# EAGLE design tick-mk-4.4 (EAGLE 6.5.0)
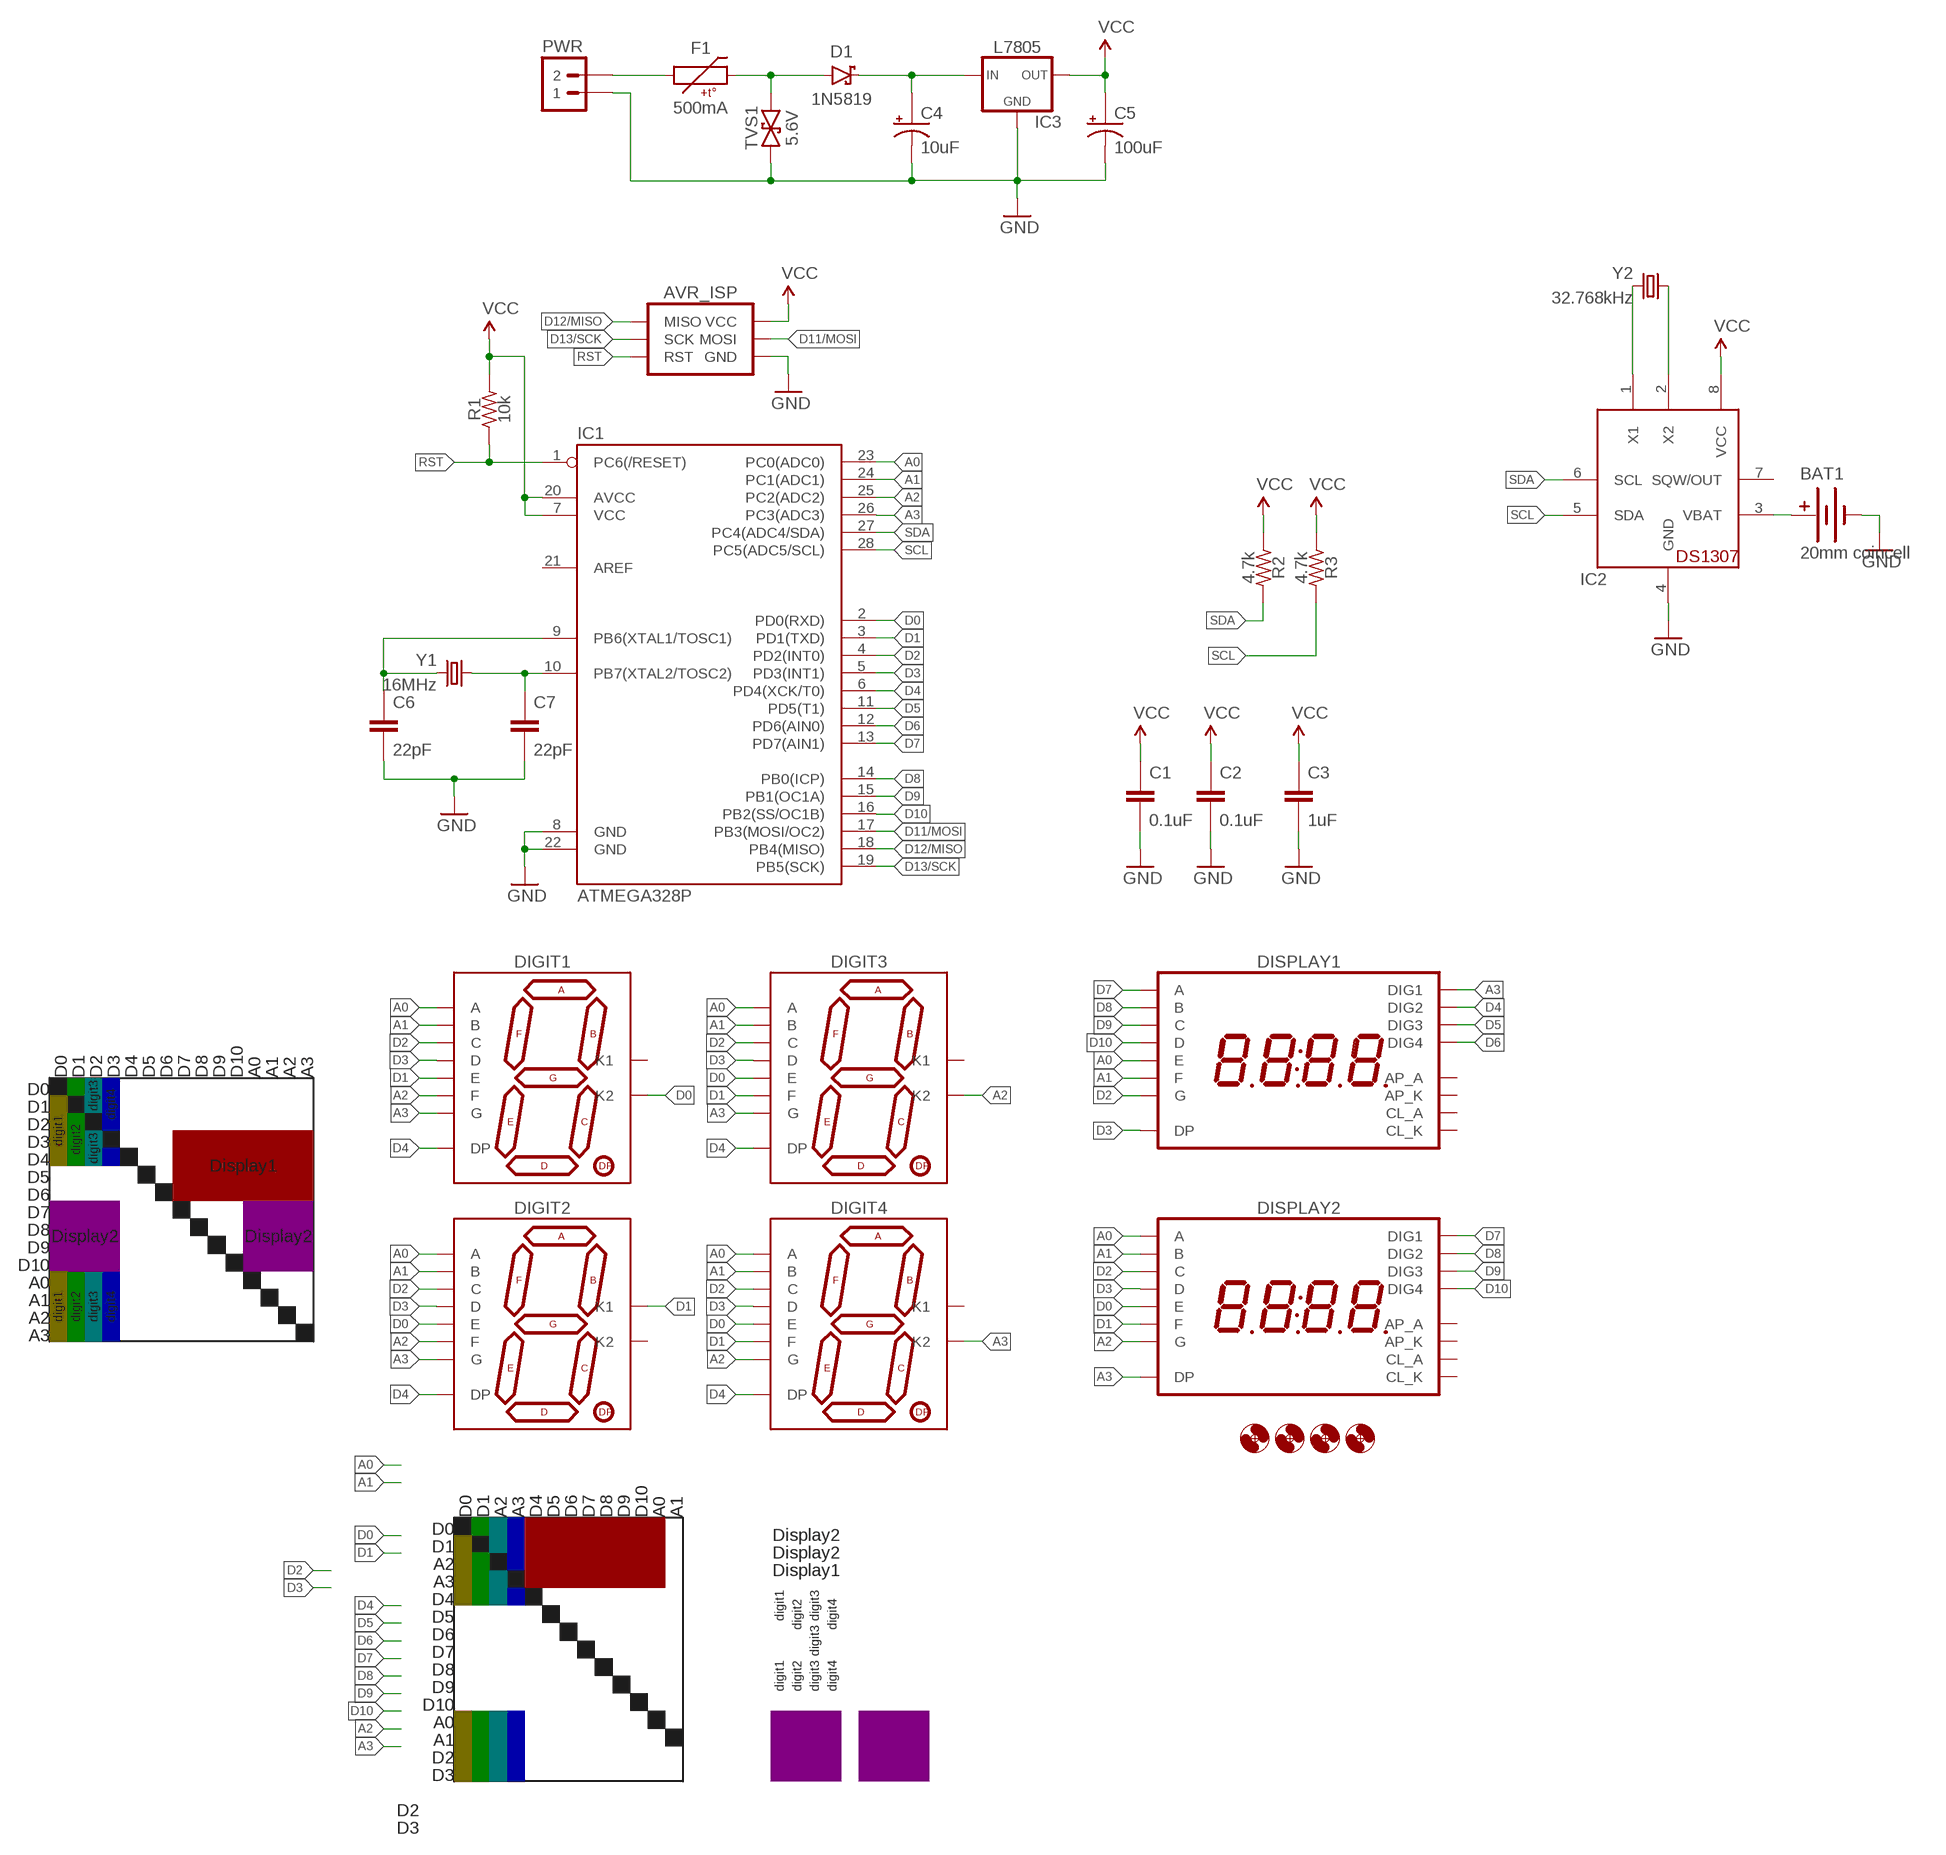
[diagram p0: schematic, sheet 1]

## Parts
AVR_ISP  AVR_SPI_PRG_6PTH  [2X3]
BAT1  20mm coincell  BATTERY20MMSMD-MINE  [BATTCON_20MM_MINE]
C1  0.1uF  CAPACITOR-CERAMIC025-024X044  [C025-024X044]
C2  0.1uF  CAPACITOR-CERAMIC025-024X044  [C025-024X044]
C3  1uF  CAPACITOR-CERAMIC025-024X044  [C025-024X044]
C4  10uF  CAPACITOR-POLARIZEDE2-5  [E2-5]
C5  100uF  CAPACITOR-POLARIZEDE2.5-6  [E2,5-6]
C6  22pF  CAPACITOR-CERAMIC025-024X044  [C025-024X044]
C7  22pF  CAPACITOR-CERAMIC025-024X044  [C025-024X044]
D1  1N5819  DIODE-SCHOTTKYPTH-10.16MM  [DIODE-10.16MM]
DIGIT1  7SEG_1DIGPTH-25.4MM-BARE  [7SEG_1DIG_25.4MM_NOSILK]
DIGIT2  7SEG_1DIGPTH-25.4MM-BARE  [7SEG_1DIG_25.4MM_NOSILK]
DIGIT3  7SEG_1DIGPTH-25.4MM-BARE  [7SEG_1DIG_25.4MM_NOSILK]
DIGIT4  7SEG_1DIGPTH-25.4MM-BARE  [7SEG_1DIG_25.4MM_NOSILK]
DISPLAY1  7SEG_4DIGIT_COLON_APOS  [7SEG_4DIG_10MM]
DISPLAY2  7SEG_4DIGIT_COLON_APOS  [7SEG_4DIG_10MM]
F1  500mA  PTCPTH-5.08MM  [PTC-PTH-5.08MM]
H1  HOLE#2  [HOLE-#2]
H2  HOLE#2  [HOLE-#2]
H3  HOLE#2  [HOLE-#2]
H4  HOLE#2  [HOLE-#2]
IC1  ATMEGA328P  ATMEGA328P_PDIP  [DIL28-3]
IC2  DS1307  [DIL08]
IC3  L7805  V_REG_78XXTO-220-THERMPAD  [TO220-IGO-THERMPAD]
PWR  M02JST-PTH-VERT  [JST-2-PH-VERT-PTH]
R1  10k  RESISTORPTH-AXIAL-7.62MM  [RESISTOR-AXIAL-PTH-7.62MM]
R2  4.7k  RESISTORPTH-AXIAL-7.62MM  [RESISTOR-AXIAL-PTH-7.62MM]
R3  4.7k  RESISTORPTH-AXIAL-7.62MM  [RESISTOR-AXIAL-PTH-7.62MM]
TVS1  5.6V  TVSDO-41-10.16MM  [DO-41-TVS-BI-10.16MM]
Y1  16MHz  CRYSTALHC49UV  [HC49U-V]
Y2  32.768kHz  CRYSTALTC26H  [TC26H]

## Nets
A0: DIGIT1.7(A) DIGIT2.7(A) DIGIT3.7(A) DIGIT4.7(A) DISPLAY1.5(E) DISPLAY2.14(A) IC1.23(PC0(ADC0))
A1: DIGIT1.6(B) DIGIT2.6(B) DIGIT3.6(B) DIGIT4.6(B) DISPLAY1.11(F) DISPLAY2.16(B) IC1.24(PC1(ADC1))
A2: DIGIT1.9(F) DIGIT2.9(F) DIGIT3.8(K2) DIGIT4.10(G) DISPLAY2.15(G) IC1.25(PC2(ADC2))
A3: DIGIT1.10(G) DIGIT2.10(G) DIGIT3.10(G) DIGIT4.8(K2) DISPLAY1.1(DIG1) DISPLAY2.7(DP) IC1.26(PC3(ADC3))
D0: DIGIT1.8(K2) DIGIT2.1(E) DIGIT3.1(E) DIGIT4.1(E) DISPLAY2.5(E) IC1.2(PD0(RXD))
D1: DIGIT1.1(E) DIGIT2.3(K1) DIGIT3.9(F) DIGIT4.9(F) DISPLAY2.11(F) IC1.3(PD1(TXD))
D2: DIGIT1.4(C) DIGIT2.4(C) DIGIT3.4(C) DIGIT4.4(C) DISPLAY1.15(G) DISPLAY2.13(C) IC1.4(PD2(INT0))
D3: DIGIT1.2(D) DIGIT2.2(D) DIGIT3.2(D) DIGIT4.2(D) DISPLAY1.7(DP) DISPLAY2.3(D) IC1.5(PD3(INT1))
D4: DIGIT1.5(DP) DIGIT2.5(DP) DIGIT3.5(DP) DIGIT4.5(DP) DISPLAY1.2(DIG2) IC1.6(PD4(XCK/T0))
D5: DISPLAY1.6(DIG3) IC1.11(PD5(T1))
D6: DISPLAY1.8(DIG4) IC1.12(PD6(AIN0))
D7: DISPLAY1.14(A) DISPLAY2.1(DIG1) IC1.13(PD7(AIN1))
D8: DISPLAY1.16(B) DISPLAY2.2(DIG2) IC1.14(PB0(ICP))
D9: DISPLAY1.13(C) DISPLAY2.6(DIG3) IC1.15(PB1(OC1A))
D10: DISPLAY1.3(D) DISPLAY2.8(DIG4) IC1.16(PB2(SS/OC1B))
D11/MOSI: AVR_ISP.4(MOSI) IC1.17(PB3(MOSI/OC2))
D12/MISO: AVR_ISP.1(MISO) IC1.18(PB4(MISO))
D13/SCK: AVR_ISP.3(SCK) IC1.19(PB5(SCK))
GND: AVR_ISP.6(GND) BAT1.BOTTOM(-) C1.2 C2.2 C3.2 C4.- C5.- C6.2 C7.2 IC1.8(GND) IC1.22(GND) IC2.4(GND) IC3.4(GND) IC3.GND PWR.1 TVS1.P$1
N$1: BAT1.TOP@1(+) BAT1.TOP@2(+) IC2.3(VBAT)
N$2: IC2.1(X1) Y2.2
N$3: IC2.2(X2) Y2.1
N$4: D1.A F1.P$2 TVS1.P$2
N$6: C6.1 IC1.9(PB6(XTAL1/TOSC1)) Y1.2
N$7: F1.P$1 PWR.2
N$8: C4.+ D1.C IC3.IN
N$9: C7.1 IC1.10(PB7(XTAL2/TOSC2)) Y1.1
RST: AVR_ISP.5(RST) IC1.1(PC6(/RESET)) R1.P$1
SCL: IC1.28(PC5(ADC5/SCL)) IC2.5(SDA) R3.P$2
SDA: IC1.27(PC4(ADC4/SDA)) IC2.6(SCL) R2.P$2
VCC: AVR_ISP.2(VCC) C1.1 C2.1 C3.1 C5.+ IC1.7(VCC) IC1.20(AVCC) IC2.8(VCC) IC3.OUT R1.P$2 R2.P$1 R3.P$1
Unconnected: DIGIT1.3(K1) DIGIT2.8(K2) DIGIT3.3(K1) DIGIT4.3(K1) DISPLAY1.4(CL_A) DISPLAY1.9(AP_K) DISPLAY1.10(AP_A) DISPLAY1.12(CL_K) DISPLAY2.4(CL_A) DISPLAY2.9(AP_K) DISPLAY2.10(AP_A) DISPLAY2.12(CL_K) IC1.21(AREF) IC2.7(SQW/OUT)

## Notes on the sheet
- D0 | D1 | D2 | D3 | D4 | D5 | D6 | D7 | D8 | D9 | D10 | A0 | A1 | A2 | A3
- D0 | digit3
- digit4
- D1
- D2 | digit1
- digit2
- D3 | digit3
- D4 | Display1
- D5
- D6
- D7
- D8 | Display2 | Display2
- D9
- D10
- A0
- A1 | digit1 | digit2 | digit3 | digit4
- A2
- A3
- D0 | D1 | A2 | A3 | D4 | D5 | D6 | D7 | D8 | D9 | D10 | A0 | A1
- D0 | Display2
- D1 | Display2
- A2 | Display1
- A3
- D4 | digit1 | digit3
- digit2 | digit4
- D5
- D6 | digit3
- D7
- D8 | digit1 | digit2 | digit3 | digit4
- D9
- D10
- A0
- A1
- D2
- D3
- D2
- D3

## Library data of the parts
AVR_ISP = A_butts:AVR_SPI_PRG_6: AVR ISP 6 Pin This is the reduced ISP connector for AVR programming. Common on Arduino. This footprint will take up less PCB space and can be used with a 10-pin to 6-pin adapter such as SKU: BOB-08508 **Special note about "TEST_POINT" package. The stop mask is on the top side, so if you want your programming test points to be on the bottom of your board, make sure to place this package on the bottom side of the board. This also ensure that the orientation to program from the bottom side will be correct.
BAT1 = A_butts:BATTERY: Battery Holders Various common sizes : AA, AAA, 20mm coin cell and 12mm coin cell. 20MM_4LEGS, BATT-10373
C1-C3 C6 C7 = A_butts:CAPACITOR-CERAMIC: CAPACITOR, European symbol
C4 C5 = A_butts:CAPACITOR-POLARIZED: POLARIZED CAPACITOR, American symbol
D1 = A_butts:DIODE-SCHOTTKY: Schottky diodes in SFE's production catalog BAT20J 1A 23V 0.62Vf RB751 120mA 40V 0.37Vf PMEG4005EJ 0.5A 40V 0.42Vf MBRA140 1A 40V 0.5Vf B340A 3A 40V SMA
DIGIT1-DIGIT4 = A_butts:7SEG_1DIG
DISPLAY1 DISPLAY2 = A_butts:7SEG_4DIGIT_COLON_APOS
F1 = A_butts:PTC: Resettable Fuse PTC Resettable Fuse. Spark Fun Electronics SKU : COM-08357
H1-H4 = A_butts:HOLE: MOUNTING HOLE with drill center marker
IC1 = A_butts:ATMEGA328P_PDIP: uC used in the Arduino 32kb flash, 1k EEPROM, 2k SRAM This is the through-hole version of this chip.
IC2 = A_butts:DS1307: DS1307 Real time clock (RTC) with battery backup ability. Talk to it via i2c
IC3 = A_butts:V_REG_78XX: Voltage Regulator Standard 7805 5V regulator. IGO (Input Ground Output). Spark Fun Electronics SKU : COM-00107
PWR = A_butts:M02: Standard 2-pin 0.1" header. Use with - straight break away headers ( PRT-00116) - right angle break away headers (PRT-00553) - swiss pins (PRT-00743) - machine pins (PRT-00117) - female headers (PRT-00115) Molex polarized connector foot print use with: PRT-08233 with associated crimp pins and housings. 2.54_SCREWTERM for use with PRT-10571. 3.5mm Screw Terminal footprints for PRT-08084 5mm Screw Terminal footprints for use with PRT-08433
R1-R3 = A_butts:RESISTOR: RESISTOR, American symbol
TVS1 = A_butts:TVS: Transient voltage suppressor- prevents ESD on inputs. Ignore package description- MBRA140 is NOT this type of part!!!
Y1 Y2 = A_butts:CRYSTAL: Various standard crystals. Proven footprints. Spark Fun Electronics SKU : COM-00534

## Board
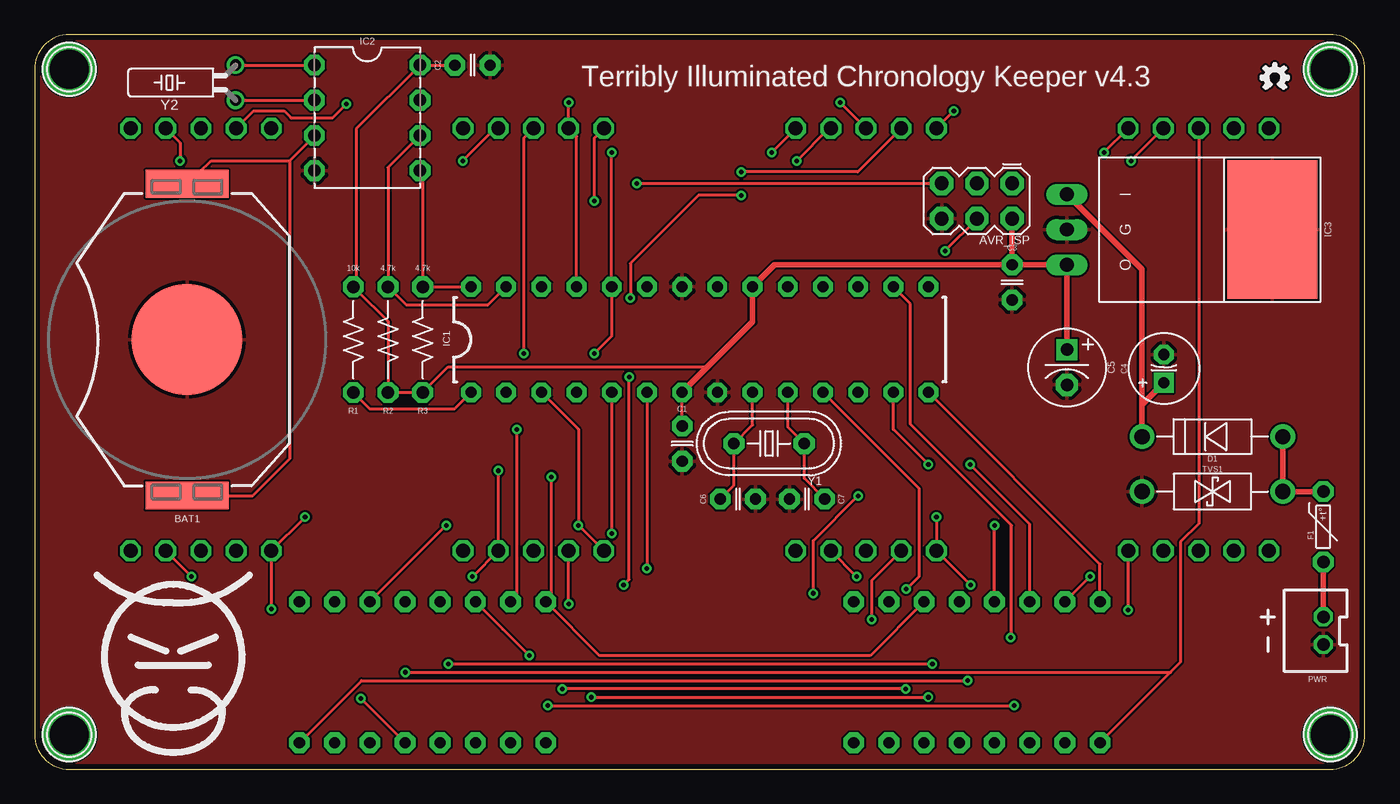
[diagram p1: board, top side]
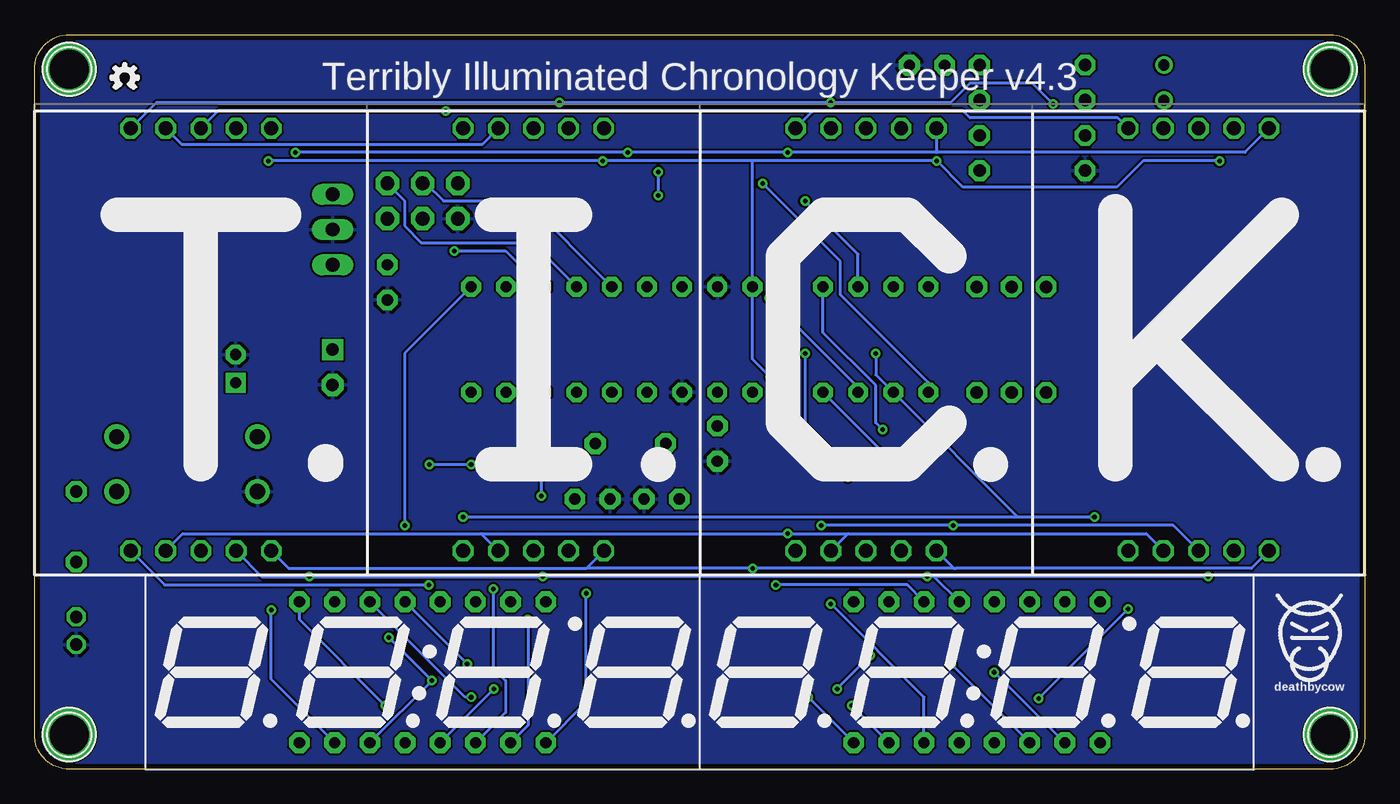
[diagram p2: board, bottom side, seen from below]

Size 96 x 53 mm. Coordinates in mm from the lower left corner, seen from the top.
Outline: 96,2.5 96,50.5 arc90 93.5,53 2.5,53 arc90 0,50.5 0,2.5 arc90 2.5,0 93.5,0 arc90 96,2.5
Copper layers (1*16): Top 0.0356mm / dielectric 1.5011mm / Bottom 0.0356mm
Design rules "LaenPCBOrder2": minimum track width 6mil, minimum drill 13mil, track to track 6mil, track to pad 6mil, pad to pad 6mil, via to via 6mil, smd to smd 6mil, copper to edge 15mil, drill to drill 6mil, minimum pad ring 7mil, minimum via ring 7mil, stop-mask expansion 3mil, vias tented up to drill 20mil, thermal gap 10mil

### Footprints (pad centres in the part's own frame; a part is rotated, then mirrored left to right if it is on the bottom)
2X3 = drill 1 pad 1.676 octagon: 1 -2.54,-1.27; 2 -2.54,1.27; 3 0,-1.27; 4 0,1.27; 5 2.54,-1.27; 6 2.54,1.27
BATTCON_20MM_MINE = smd 8 x 8: BOTTOM 0,0 | smd 6 x 2: TOP@1 0,11.25; TOP@2 0,-11.25
C025-024X044 = drill 0.813 pad 1.5 octagon: 1 -1.27,0; 2 1.27,0
E2-5 = drill 0.813 pad 1.422 square: + -1.016,0 | drill 0.813 pad 1.422 octagon: - 1.016,0
E2,5-6 = drill 0.9 pad 1.524 square: + -1.27,0 | drill 0.9 pad 1.6 octagon: - 1.27,0
DIODE-10.16MM = drill 1.1 pad 1.778: A -5.08,0; C 5.08,0
7SEG_1DIG_25.4MM_NOSILK = drill 1 pad 1.5 octagon: 1 -5.08,-15.24; 2 -2.54,-15.24; 3 0,-15.24; 4 2.54,-15.24; 5 5.08,-15.24; 6 5.08,15.24; 7 2.54,15.24; 8 0,15.24; 9 -2.54,15.24; 10 -5.08,15.24
7SEG_4DIG_10MM = drill 0.8 pad 1.5 octagon: 1 -8.89,-5.08; 2 -6.35,-5.08; 3 -3.81,-5.08; 4 -1.27,-5.08; 5 1.27,-5.08; 6 3.81,-5.08; 7 6.35,-5.08; 8 8.89,-5.08; 9 8.89,5.08; 10 6.35,5.08; 11 3.81,5.08; 12 1.27,5.08; 13 -1.27,5.08; 14 -3.81,5.08; 15 -6.35,5.08; 16 -8.89,5.08
PTC-PTH-5.08MM = drill 0.9 pad 1.5 octagon: P$1 -2.54,0; P$2 2.54,0
HOLE-#2 = drill 2.8 pad 3.81: P$1 0,0
DIL28-3 = drill 0.8 pad 1.422 octagon: 1 -16.51,-3.81; 2 -13.97,-3.81; 3 -11.43,-3.81; 4 -8.89,-3.81; 5 -6.35,-3.81; 6 -3.81,-3.81; 7 -1.27,-3.81; 8 1.27,-3.81; 9 3.81,-3.81; 10 6.35,-3.81; 11 8.89,-3.81; 12 11.43,-3.81; 13 13.97,-3.81; 14 16.51,-3.81; 15 16.51,3.81; 16 13.97,3.81; 17 11.43,3.81; 18 8.89,3.81; 19 6.35,3.81; 20 3.81,3.81; 21 1.27,3.81; 22 -1.27,3.81; 23 -3.81,3.81; 24 -6.35,3.81; 25 -8.89,3.81; 26 -11.43,3.81; 27 -13.97,3.81; 28 -16.51,3.81
DIL08 = drill 0.9 pad 1.5 octagon: 1 -3.81,-3.81; 2 -1.27,-3.81; 3 1.27,-3.81; 4 3.81,-3.81; 5 3.81,3.81; 6 1.27,3.81; 7 -1.27,3.81; 8 -3.81,3.81
TO220-IGO-THERMPAD = smd 10 x 6.5: 4 0,11 | drill 1 long: GND 0,-3.81; IN -2.54,-3.81; OUT 2.54,-3.81
JST-2-PH-VERT-PTH = drill 0.9 octagon: 1 -1,0; 2 1,0
RESISTOR-AXIAL-PTH-7.62MM = drill 0.9 pad 1.5 octagon: P$1 -3.81,0; P$2 3.81,0
DO-41-TVS-BI-10.16MM = drill 1.1 pad 1.778: P$1 -5.08,0; P$2 5.08,0
HC49U-V = drill 0.813 pad 1.524 octagon: 1 -2.54,0; 2 2.54,0
TC26H = drill 0.8 pad 1.27: 1 -1.27,0; 2 1.27,0

### Placement (x,y rotation side)
AVR_ISP  68,41 180 top
BAT1  11,31 180 top
C1  46.73,23.5 270 top
C2  31.6,50.8 0 top
C3  70.54,35.13 270 top
C4  81.5,28.9 90 top
C5  74.5,29 270 top
C6  50.75,19.5 0 top
C7  55.75,19.5 180 top
D1  85,24 180 top
DIGIT1  36,31 0 bottom
DIGIT2  12,31 0 bottom
DIGIT3  60,31 0 bottom
DIGIT4  84,31 0 bottom
DISPLAY1  68,7 0 bottom
DISPLAY2  28,7 0 bottom
F1  93,17.5 90 top
H1  2.5,2.5 0 top
H2  2.5,50.5 0 top
H3  93.5,2.5 0 top
H4  93.5,50.5 0 top
IC1  48,31 0 top
IC2  24,47 270 top
IC3  78.31,38.94 270 top
PWR  93,10 90 top
R1  23,31 90 top
R2  25.5,31 90 top
R3  28,31 90 top
TVS1  85,20.04 0 top
U$3  [COW]  10,7 0 top
U$4  [COW_SMALL]  4,10 0 bottom
U$6  [OSHWLOGO_MINI]  89.5,49.9 0 bottom
U$7  [OSHWLOGO_MINI]  89.5,49.9 0 top
Y1  53,23.5 180 top
Y2  14.5,49.54 90 top

### Tracks (layer width: path | path; a pad name or v marks a point on that pad's centre or on a via)
A0  (via drill 0.33)
  Top 0.2: DIGIT2.7 10.5,45.2 v10.5,43.9 | v30.9,43.9 33.24,46.24 DIGIT1.7 | v55,43.9 57.34,46.24 DIGIT3.7 | v79.12,43.9 DIGIT4.7 | v62.85,5.8 v38.09,5.8 | v35.7,8.2 33.79,10.1 DISPLAY2.14 | v42.5,13.3 42.9,13.7 v42.9,28.3
  Bottom 0.2: v10.5,43.9 16,43.9 17.9,42 29,42 v30.9,43.9 44.19,43.9 | 44.19,43.9 v55,43.9 v79.12,43.9 | 44.19,43.9 IC1.23 44.19,29.59 v42.9,28.3 | DISPLAY1.5 v62.85,5.8 | v38.09,5.8 v38.09,5.81 v35.7,8.2 | DISPLAY2.14 33.03,13.3 v42.5,13.3
A1  (via drill 0.33)
  Top 0.2: v53.2,44.5 54.92,46.22 DIGIT3.6 | v77.18,44.5 DIGIT4.6 | v41.65,44.5 IC1.24 41.65,31.25 v40.4,30 | DISPLAY1.11 60.31,8.2 40.77,8.2 DISPLAY2.16 37.3,12.49 v37.3,21.1
  Bottom 0.2: DIGIT2.6 8.66,44.5 30.92,44.5 | 30.92,44.5 v41.65,44.5 v53.2,44.5 v77.18,44.5 | DIGIT1.6 30.92,44.5 | v40.4,30 40.4,24.9 37.3,21.8 v37.3,21.1
A2  (via drill 0.33)
  Top 0.2: DIGIT2.9 15.8,47.5 18,47.5 18.5,47 21.5,47 v22.5,48 | v38.54,48.1 DIGIT1.9 39.11,45.67 IC1.25 | DIGIT3.8 v58.14,48.1 | DISPLAY2.15 34.8,12.53 v34.8,24.5
  Bottom 0.2: v22.5,48 24,49.5 28.5,49.5 29.9,48.1 v38.54,48.1 v58.14,48.1 87.22,48.1 DIGIT4.10 | v34.8,24.5 35.3,25 35.3,27.7 39.1,31.5 IC1.25
A3  (via drill 0.33)
  Top 0.2: DIGIT3.10 v66.34,47.5 | v40.4,41 40.4,45.56 DIGIT1.10 | DIGIT4.8 84,17.7 82.7,16.4 82.7,7.73 81.97,7 | 81.97,7 DISPLAY1.1 | v26.75,7 81.97,7
  Bottom 0.2: DIGIT2.10 17.84,47 28.5,47 29,47.5 39.82,47.5 | 39.82,47.5 v66.34,47.5 82.74,47.5 DIGIT4.8 | DIGIT1.10 39.82,47.5 | IC1.26 36.57,37.17 v40.4,41 | DISPLAY2.7 v26.75,7
D0  (via drill 0.33)
  Top 0.2: DIGIT1.8 35.3,45.54 v35.3,30 | v67.54,13.3 DIGIT3.1 v65.08,18.2 | v19.52,18.2 DIGIT2.1 v17.08,11.57 | DISPLAY2.5 v23.55,5.1
  Bottom 0.2: v35.3,30 35.3,28.46 IC1.2 25.04,18.2 v19.52,18.2 v65.08,18.2 | DIGIT4.1 86.62,13.3 v67.54,13.3 | v17.08,11.57 v23.55,5.1
D1  (via drill 0.33)
  Top 0.2: DIGIT3.9 59.4,43.1 v51,43.1 | v51,41.4 47.9,41.4 43,36.5 v43,34 | DIGIT1.1 v39.24,17.6 39.24,24.52 IC1.3 | DISPLAY2.11 v29.71,17.6
  Bottom 0.2: DIGIT4.9 85.4,45.1 63.68,45.1 DIGIT3.9 | v51,43.1 v51,41.4 | v43,34 36.57,27.57 IC1.3 | DIGIT2.3 13.84,17.6 v29.71,17.6 v39.24,17.6
D2  (via drill 0.33)
  Top 0.2: v59.32,13.9 DIGIT3.4 | DISPLAY1.15 v76.17,13.9 | DIGIT2.4 v11.32,13.9 | v31.6,13.9 DIGIT1.4 v33.46,21.54
  Bottom 0.2: DIGIT4.4 79.6,13.9 v76.17,13.9 v59.32,13.9 v31.6,13.9 | v11.32,13.9 31.09,13.9 | 31.09,13.9 v31.6,13.9 | DISPLAY2.13 31.09,13.9 | v31.6,13.9 31.4,13.9 | IC1.4 v33.46,21.54
D3  (via drill 0.33)
  Top 0.2: v38.54,11.94 DIGIT1.2 | IC1.5 v41.65,17 | DIGIT3.2 60.4,13.62 v60.4,10.8
  Bottom 0.2: DIGIT4.2 85.3,17 63.78,17 | 63.78,17 v41.65,17 37.3,17 | 37.3,17 15.78,17 DIGIT2.2 | DIGIT3.2 63.78,17 | DISPLAY2.3 31.81,5.21 v38.54,11.94 | DIGIT1.2 37.3,17 | v60.4,10.8 60.4,3.17 DISPLAY1.7
D4  (via drill 0.33)
  Top 0.2: v78.92,11.5 DIGIT4.5 | IC1.6 v44.19,14.5
  Bottom 0.2: DIGIT4.5 77.66,14.5 56.18,14.5 | 56.18,14.5 DIGIT3.5 | DISPLAY1.2 78.92,6.49 v78.92,11.5 | DIGIT2.5 8.18,14.5 29.5,14.5 29.66,14.5 | 29.66,14.5 v44.19,14.5 56.18,14.5 | DIGIT1.5 29.66,14.5
D5  (via drill 0.33)
  Top 0.2: IC1.11 63.8,20.28 63.8,13.9 v62.9,13
  Bottom 0.2: v62.9,13 62.9,7.3 62,6.4 62,4.11 DISPLAY1.6
D6  (via drill 0.33)
  Top 0.2: v56.2,12.7 56.2,16.5 v59.43,19.73
  Bottom 0.2: DISPLAY1.8 56.2,4.83 v56.2,12.7 | v59.43,19.73 IC1.12
D7  (via drill 0.33)
  Top 0.2: v40.17,5.2 v64.5,5.2 | DISPLAY1.14 71.81,17.69 v67.5,22 | v64.5,22 61.97,24.53 IC1.13
  Bottom 0.2: DISPLAY2.1 v40.17,5.2 | v64.5,5.2 64.93,5.2 DISPLAY1.14 | v67.5,22 v64.5,22
D8  (via drill 0.33)
  Top 0.2: DISPLAY1.16 76.89,14.81 IC1.14 | v37.03,4.6 v70.7,4.6
  Bottom 0.2: DISPLAY2.2 v37.03,4.6 | v70.7,4.6 76.89,10.79 DISPLAY1.16
D9  (via drill 0.33)
  Top 0.2: v29.87,7.6 v64.79,7.6 | DISPLAY1.13 v69.27,17.6
  Bottom 0.2: DISPLAY2.6 v29.87,7.6 | v64.79,7.6 DISPLAY1.13 | v69.27,17.6 69.27,30.05 IC1.15
D10  (via drill 0.33)
  Top 0.2: DISPLAY2.8 23.59,6.4 v67.33,6.4 | v70.43,9.5 70.5,9.57 70.5,17.6 63.2,24.9 63.2,33.58 IC1.16
  Bottom 0.2: DISPLAY1.3 v67.33,6.4 v70.43,9.5
D11/MOSI  (via drill 0.33)
  Top 0.2: AVR_ISP.4 68,39.7 v65.7,37.4
  Bottom 0.2: v65.7,37.4 62.02,37.4 IC1.17
D12/MISO
  Bottom 0.2: AVR_ISP.1 70.54,42.24 69.3,41 69.3,39.2 68.1,38 60.08,38 IC1.18
D13/SCK
  Bottom 0.2: AVR_ISP.3 67.77,42.27 66.5,41 60.54,41 IC1.19
GND
  pour Bottom: 2.5,53 93.5,53 arc-90 96,50.5 96,2.5 arc-90 93.5,0 2.5,0 arc-90 0,2.5 0,50.5 arc-90
  pour Top: 2.5,53 93.5,53 arc-90 96,50.5 96,2.5 arc-90 93.5,0 2.5,0 arc-90 0,2.5 0,50.5 arc-90
N$1
  Top 0.2: BAT1.TOP@2 12.75,43.9 18.4,43.9 | 18.4,43.9 20.19,45.69 IC2.3 | BAT1.TOP@1 15.75,19.75 18.4,22.4 18.4,43.9
N$2
  Top 0.2: Y2.2 IC2.1
N$3
  Top 0.2: Y2.1 IC2.2
N$4
  Top 0.4: D1.A TVS1.P$2 F1.P$2
N$6
  Top 0.2: IC1.9 51.81,24.85 Y1.2 50.46,20.48 C6.1
N$7
  Top 0.4: PWR.2 F1.P$1
N$8
  Top 0.4: IC3.IN 79.92,36.06 D1.C 79.92,26.3 C4.+
N$9
  Top 0.2: IC1.10 54.35,24.69 Y1.1 55.54,20.98 C7.1
RST  (via drill 0.33)
  Top 0.2: R1.P$1 24.19,26 30.3,26 IC1.1 | v43.47,42.27 AVR_ISP.5
  Bottom 0.2: IC1.1 31.49,27.89 37.85,34.25 37.85,36.65 v43.47,42.27
SCL
  Top 0.2: IC2.5 28,43 R3.P$2 IC1.28
SDA
  Top 0.2: IC2.6 25.5,43.42 R2.P$2 26.81,33.5 32.72,33.5 IC1.27
VCC
  Top 0.2: R1.P$2 23.2,34.6 | 23.2,34.6 25.5,32.31 R2.P$1 R3.P$1 29.84,29.03 48.57,29.03 | 23.2,34.6 23.2,46.2 IC2.8 C2.1 | C1.1 IC1.7
  Top 0.4: C3.1 53.4,36.4 IC1.20 51.81,32.27 48.57,29.03 IC1.7 | AVR_ISP.2 C3.1 | C3.1 IC3.OUT C5.+

### Text on the board
tPlace: Terribly Illuminated Chronology Keeper v4.3
bPlace: Terribly Illuminated Chronology Keeper v4.3